# EAGLE design TAH Arduino Breakout Shield (EAGLE 7.0.0)
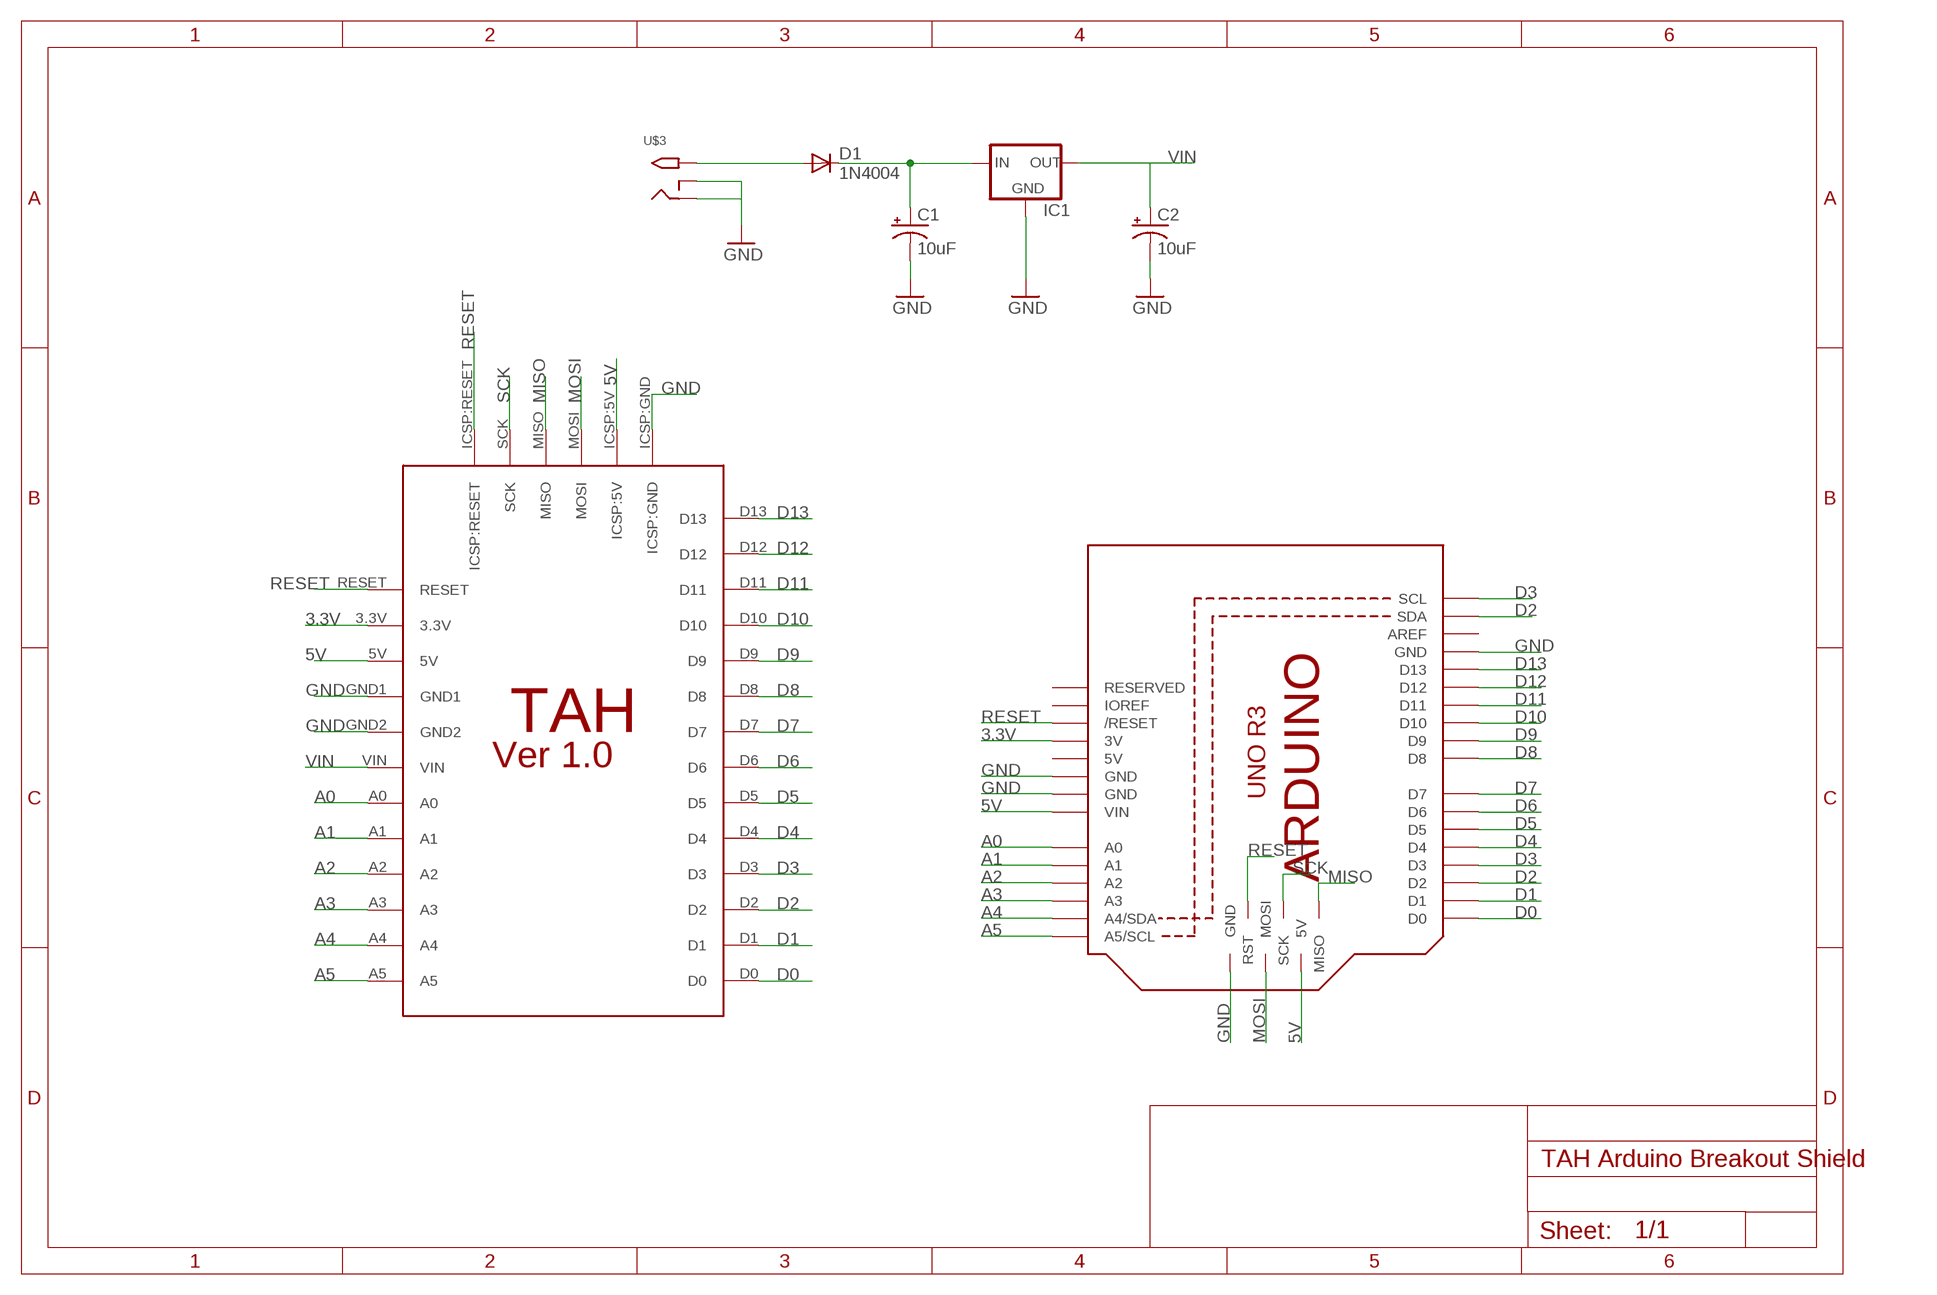
[diagram p0: schematic, sheet 1]

## Parts
C1  10uF  CPOL-USE2,5-6E  [E2,5-6E]
C2  10uF  CPOL-USE2,5-6E  [E2,5-6E]
D1  1N4004  [DO41-10]
IC1  V_REG_78XX-TO-220  [TO-220-ALT]
M1  ARDUINO_R3_ICSP_NODIM  [ARDUINOR3_ICSP_NODIM]
U$1  TAH_PIN_FOOTPRINT_VER1.0  [TAH_PIN_FOOTPRINT_VER1.0]
U$3  2.1MMJACKTHM  [PJ-102A]

## Nets
3.3V: M1.3V U$1.3.3V
5V: M1.5V_ICSP(5V) M1.VIN U$1.5V U$1.ICSP:5V
A0: M1.A0 U$1.A0
A1: M1.A1 U$1.A1
A2: M1.A2 U$1.A2
A3: M1.A3 U$1.A3
A4: M1.A4(A4/SDA) U$1.A4
A5: M1.A5(A5/SCL) U$1.A5
D0: M1.D0 U$1.D0
D1: M1.D1 U$1.D1
D2: M1.D2 M1.SDA U$1.D2
D3: M1.D3 M1.SCL U$1.D3
D4: M1.D4 U$1.D4
D5: M1.D5 U$1.D5
D6: M1.D6 U$1.D6
D7: M1.D7 U$1.D7
D8: M1.D8 U$1.D8
D9: M1.D9 U$1.D9
D10: M1.D10 U$1.D10
D11: M1.D11 U$1.D11
D12: M1.D12 U$1.D12
D13: M1.D13 U$1.D13
GND: C1.- C2.- IC1.GND M1.GND M1.GND@1(GND) M1.GND@2(GND) M1.GND@3(GND) U$1.GND1 U$1.GND2 U$1.ICSP:GND U$3.RING U$3.RING_SW
MISO: M1.MISO U$1.MISO
MOSI: M1.MOSI U$1.MOSI
N$4: D1.A U$3.TIP
N$5: C1.+ D1.C IC1.IN
RESET: M1.RESET(/RESET) M1.RESET_ICSP(RST) U$1.ICSP:RESET U$1.RESET
SCK: M1.SCK U$1.SCK
VIN: C2.+ IC1.OUT U$1.VIN
Unconnected: M1.AREF M1.IOREF M1.RESERVED

## Power pins joined to a net without a drawn wire
5V: M1.5V

## Library data of the parts
C1 C2 = Arduino Shield Pin Out:CPOL-US: POLARIZED CAPACITOR, American symbol
D1 = adafruit:1N4004: DIODE General purpose 1N400x type rectifier (With bigger pads) http://www.ladyada.net/library/pcb/eaglelibrary.html
IC1 = SparkFun-PowerIC:V_REG_78XX: Voltage Regulator Standard 7805 5V regulator. IGO (Input Ground Output). Spark Fun Electronics SKU : COM-00107
M1 = adafruit:ARDUINO_R3_ICSP
U$1 = TAH:TAH_PIN_FOOTPRINT_VER1.0
U$3 = 1n4148 diode sot 23:2.1MMJACK: 2.1mm x 5.5mm THM DC jack with internal switch. Digikey part #PJ-102A, 4UCON part #05537 2.1mm x 5.5mm SMT DC jack with internal switch. Digikey part #PJ-002A-SMT, 4UCON part #03267 By microbuilder.eu & adafruit.com

## Net classes
0 default: clearance 0.355 mm

## Board
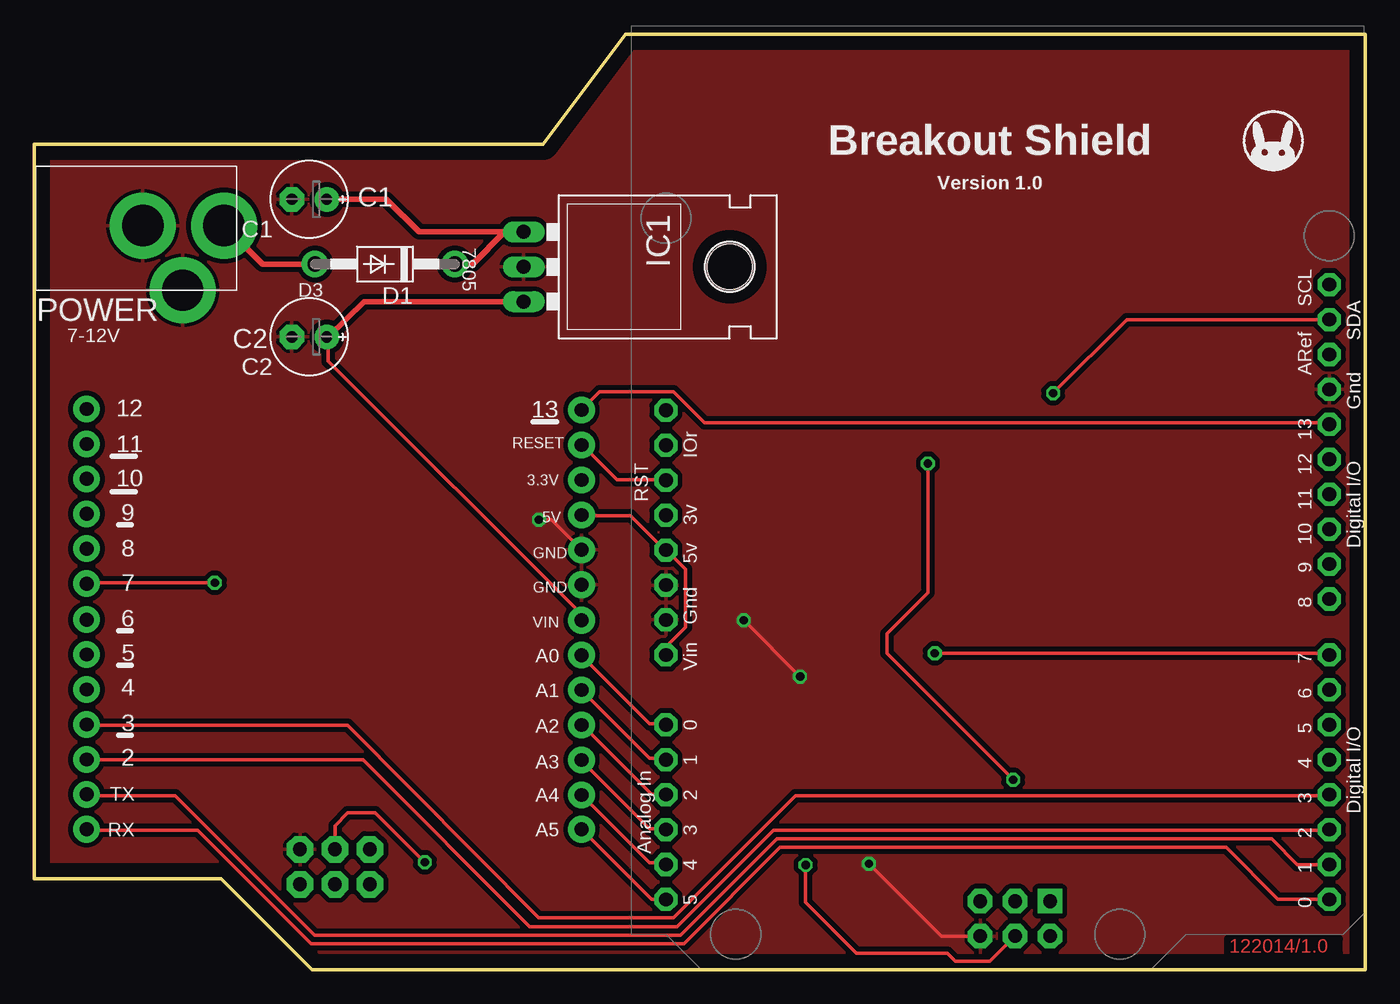
[diagram p1: board, top side]
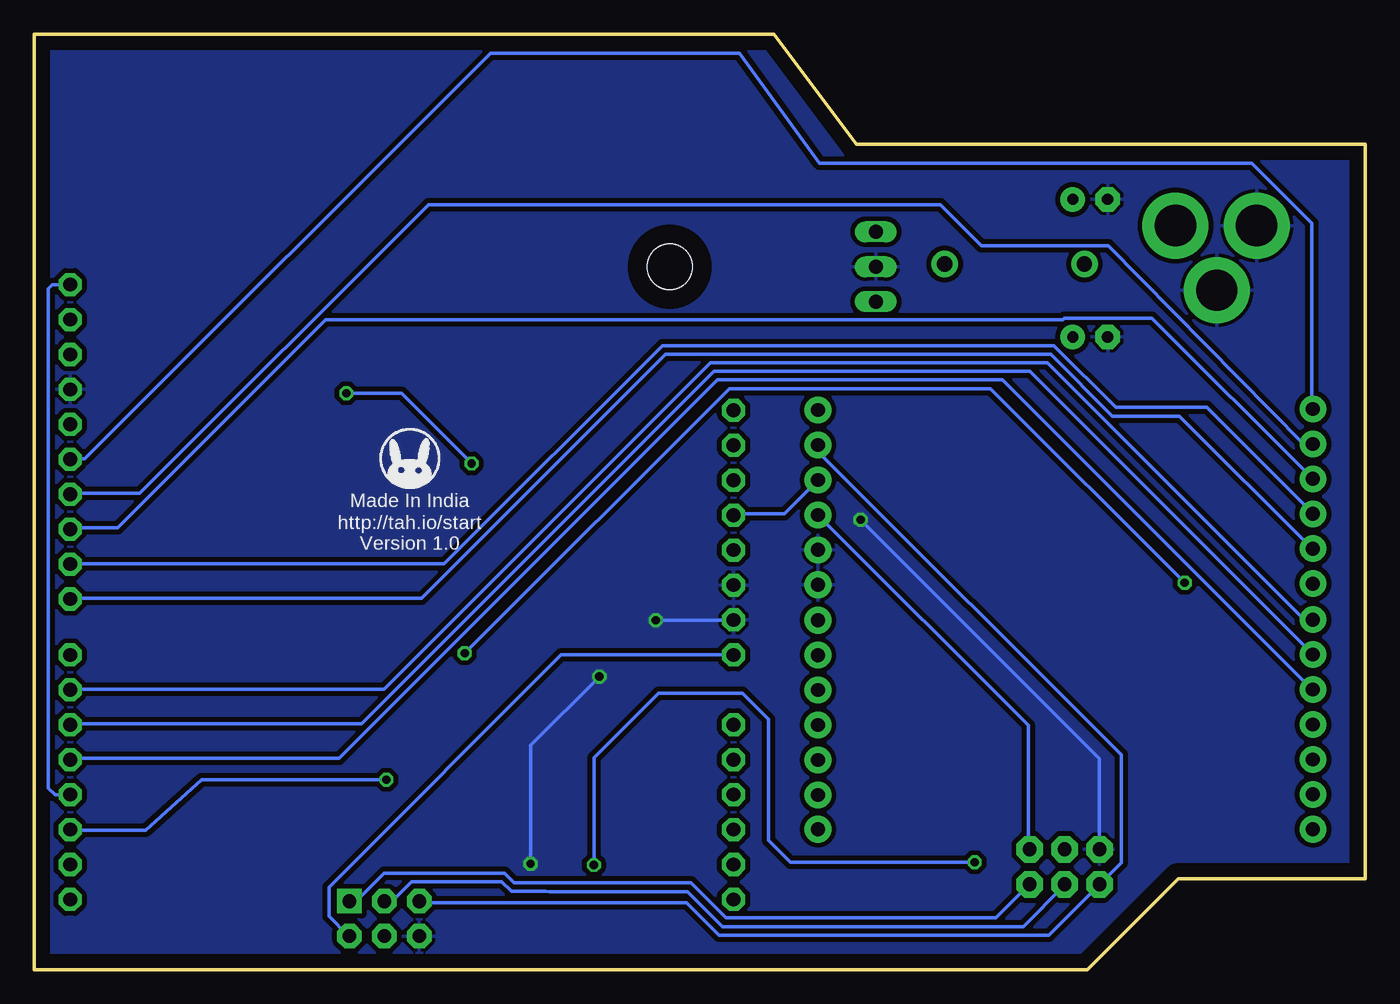
[diagram p2: board, bottom side, seen from below]

Size 96.8 x 68 mm. Coordinates in mm from the lower left corner, seen from the top.
Outline: 0,6.6 13.6,6.6 20.2,0 96.8,0 96.8,68 43,68 37,60 0,60 0,6.6
Copper layers (1*16): Top 0.035mm / dielectric 1.5mm / Bottom 0.035mm
Design rules "default": minimum track width 10mil, minimum drill 24mil, track to track 8mil, track to pad 8mil, pad to pad 8mil, via to via 8mil, smd to smd 8mil, copper to edge 40mil, drill to drill 8mil, minimum pad ring 10mil, minimum via ring 8mil, stop-mask expansion 4mil, vias tented up to drill 0mil, thermal gap 10mil

### Footprints (pad centres in the part's own frame; a part is rotated, then mirrored left to right if it is on the bottom)
E2,5-6E = drill 0.813 pad 1.778: + -1.27,0 | drill 0.813 pad 1.778 octagon: - 1.27,0
DO41-10 = drill 1.118 pad 1.93: A 5.08,0; C -5.08,0
TO-220-ALT = drill 1.016 long: GND 0,-3.81; IN -2.54,-3.81; OUT 2.54,-3.81 | hole 3.302: 0,11.176
ARDUINOR3_ICSP_NODIM = drill 1 pad 1.676 octagon: 3V 35.56,2.54; 5V 38.1,2.54; A0 50.8,2.54; A1 53.34,2.54; A2 55.88,2.54; A3 58.42,2.54; A4 60.96,2.54; A5 63.5,2.54; AREF 23.876,50.8; D0 63.5,50.8; D1 60.96,50.8; D2 58.42,50.8; D3 55.88,50.8; D4 53.34,50.8; D5 50.8,50.8; D6 48.26,50.8; D7 45.72,50.8; D8 41.656,50.8; D9 39.116,50.8; D10 36.576,50.8; D11 34.036,50.8; D12 31.496,50.8; D13 28.956,50.8; GND 26.416,50.8; GND@1 43.18,2.54; GND@2 40.64,2.54; IOREF 30.48,2.54; RESERVED 27.94,2.54; RESET 33.02,2.54; SCL 18.796,50.8; SDA 21.336,50.8; VIN 45.72,2.54 | drill 1 pad 1.778 octagon: 5V_ICSP 66.167,30.48; GND@3 66.167,25.4; MOSI 66.167,27.94; RESET_ICSP 63.627,25.4; SCK 63.627,27.94 | drill 1 pad 1.778 square: MISO 63.627,30.48
TAH_PIN_FOOTPRINT_VER1.0 = drill 1 pad 1.93: 3.3V -17.55,11.97; 5V -17.55,9.43; A0 -17.55,-0.77; A1 -17.55,-3.31; A2 -17.55,-5.85; A3 -17.55,-8.39; A4 -17.55,-10.93; A5 -17.55,-13.43; D0 18.45,-13.43; D1 18.45,-10.89; D2 18.45,-8.35; D3 18.45,-5.81; D4 18.45,-3.27; D5 18.45,-0.73; D6 18.45,1.81; D7 18.45,4.43; D8 18.45,6.97; D9 18.45,9.51; D10 18.45,12.05; D11 18.45,14.59; D12 18.45,17.13; D13 -17.55,17.05; GND1 -17.55,6.89; GND2 -17.55,4.35; RESET -17.55,14.51; VIN -17.55,1.77 | drill 1 pad 1.93 octagon: ICSP:5V -2.15,-14.89; ICSP:GND 2.93,-14.89; ICSP:RESET 2.93,-17.43; MISO -2.15,-17.43; MOSI 0.39,-14.89; SCK 0.39,-17.43
PJ-102A = drill 3 pad 4.8: RING 0.1,-3.39; RING_SW -4.6,-6.29; TIP 0.1,-9.29

### Placement (x,y rotation side)
C1  20,56 180 top
C2  20,46 180 top
D1  25.5,51.3 180 top
IC1  39.4,51.1 270 top
M1  43.4,68.6 270 top
U$1  22.25,23.63 0 bottom
U$2  [TAHLOGO]  90.1,60.3 0 top
U$3  4.5,54 90 top
U$4  [TAHLOGO]  69.5,37.2 0 bottom
U$5  [TAH_SILK_FLIPPED]  22.5,25.5 0 top

### Tracks (layer width: path | path; a pad name or v marks a point on that pad's centre or on a via)
3.3V
  Bottom 0.254: M1.3V 45.88,33.12 42.25,33.12 39.88,35.5 U$1.3.3V
5V
  Top 0.254: M1.VIN 46,23 46,23.5 47.38,24.88 47.38,29.12 46,30.5 M1.5V 45.88,30.5 43.38,33 39.88,33 U$1.5V
  Bottom 0.254: U$1.ICSP:5V 24.5,8.75 24.5,17.75 39.75,33 U$1.5V | M1.5V_ICSP 74,2.5 75.38,3.88 75.38,6 58.5,22.88 46,22.88 M1.VIN
A0
  Top 0.254: M1.A0 45.88,17.88 44.75,17.88 39.88,22.75 U$1.A0
A1
  Top 0.254: M1.A1 45.88,15.38 44.75,15.38 39.88,20.25 U$1.A1
A2
  Top 0.254: M1.A2 45.88,12.75 44.88,12.75 39.88,17.75 U$1.A2
A3
  Top 0.254: M1.A3 45.88,10.25 44.75,10.25 39.88,15.12 U$1.A3
A4
  Top 0.254: U$1.A4 44.75,7.75 45.88,7.75 M1.A4
A5
  Top 0.254: U$1.A5 44.88,5.12 45.88,5.12 M1.A5
D0
  Top 0.254: M1.D0 94.12,5.12 90.45,5.12 86.7,8.88 54.25,8.88 47.25,1.88 20.12,1.88 11.88,10.12 3.88,10.12 U$1.D0
D1
  Top 0.254: M1.D1 94.12,7.62 91.88,7.62 90,9.5 54.02,9.53 47,2.5 20.38,2.5 10.25,12.62 3.88,12.62 U$1.D1
D2  (via drill 0.6)
  Top 0.254: M1.D2 94.12,10.12 53.75,10.12 46.75,3.12 36.02,3.12 23.9,15.25 3.88,15.25 U$1.D2 | M1.SDA 79.46,47.26 v74.1,41.9 | v65,36.8 65,27.4 62,24.4 62,23 v71.2,13.8
  Bottom 0.254: v74.1,41.9 70.1,41.9 v65,36.8 | v71.2,13.8 84.62,13.8 88.7,10.12 94.14,10.12 M1.D2
D3
  Top 0.254: M1.D3 94.12,12.62 55.38,12.62 46.5,3.75 36.67,3.75 22.77,17.75 3.88,17.75 U$1.D3
  Bottom 0.254: M1.SCL 95.5,49.8 95.8,49.5 95.8,13.2 95.3,12.7 94.22,12.7 M1.D3
D4
  Bottom 0.254: M1.D4 94.12,15.38 74.62,15.38 47.12,42.88 26.38,42.88 3.88,20.38 U$1.D4
D5
  Bottom 0.254: M1.D5 94.12,17.88 73,17.88 47.38,43.5 24.38,43.5 3.88,23 U$1.D5
D6
  Bottom 0.254: M1.D6 94.12,20.38 71.38,20.38 47.62,44.12 23.12,44.12 4.5,25.5 3.88,25.5 U$1.D6
D7  (via drill 0.61)
  Top 0.254: v65.5,23 94.12,23 M1.D7 | v13.12,28.12 3.88,28.12 U$1.D7
  Bottom 0.254: v65.5,23 46.25,42.25 27.25,42.25 v13.12,28.12
D8
  Bottom 0.254: M1.D8 94.12,27 68.62,27 50.88,44.75 22.88,44.75 18.38,40.25 13.5,40.25 3.88,30.62 U$1.D8
D9
  Bottom 0.254: M1.D9 94.12,29.5 67,29.5 51.12,45.38 22.62,45.38 18.12,40.88 11.5,40.88 3.88,33.25 U$1.D9
D10
  Bottom 0.254: M1.D10 94.12,32.12 90.75,32.12 75.62,47.25 22,47.25 21.88,47.38 15.5,47.38 3.88,35.75 U$1.D10
D11
  Bottom 0.254: M1.D11 94.12,34.62 89.12,34.62 68.12,55.62 30.9,55.6 27.93,52.62 18.68,52.62 4.5,38.25 3.88,38.25 U$1.D11
D12
  Bottom 0.254: M1.D12 94.12,37.12 93.12,37.12 63.62,66.62 45.5,66.62 39.7,58.62 8.25,58.62 3.88,54.25 3.88,40.88 U$1.D12
D13
  Top 0.254: M1.D13 94.12,39.75 48.75,39.75 46.5,42 41.12,42 39.88,40.75 U$1.D13
GND  (via drill 0.6)
  Top 0.254: v36.7,32.7 37.62,32.7 U$1.GND1 | M1.GND@3 65.97,2.43 v60.7,7.7 | v55.7,21.3 v51.6,25.4
  Bottom 0.254: U$1.ICSP:GND 19.32,15.32 v36.7,32.7 | v60.7,7.7 60.7,16.3 v55.7,21.3 | v51.6,25.4 45.96,25.4 M1.GND@1
  pour Bottom: 0,6.6 0,60 37,60 43,68 97,68 97,0 20.2,0 13.6,6.6
  pour Top: 0,6.6 0,60 37,60 43,68 97,68 97,0 20.3,0 20.2,0 13.6,6.6
MISO
  Bottom 0.254: M1.MISO 73.88,5 73.38,5 71.38,7 62.6,7 61.9,6.3 49.05,6.3 46.5,3.75 26.88,3.75 24.5,6.12 U$1.MISO
MOSI  (via drill 0.6)
  Top 0.254: U$1.MOSI 21.86,10.46 22.8,11.4 24.8,11.4 v28.4,7.8 | v56.1,7.6 56.1,4.9 59.8,1.2 66.4,1.2 67,0.6 69.51,0.6 M1.MOSI
  Bottom 0.254: v28.4,7.8 41.8,7.8 43.4,9.4 43.4,18.2 45.3,20.1 51.4,20.1 56.1,15.4 v56.1,7.6
N$4
  Top 0.406: D1.A 16.59,51.3 U$3.TIP
N$5
  Top 0.406: C1.+ 25.6,56 28,53.64 34.2,53.64 | 34.2,53.64 IC1.IN | D1.C 31.86,51.3 34.2,53.64
RESET
  Top 0.254: M1.RESET 45.88,35.62 42.38,35.62 39.88,38.12 U$1.RESET
  Bottom 0.254: M1.RESET_ICSP 68.75,4.88 49.38,4.88 47,2.5 23,2.5 19.38,6.12 U$1.ICSP:RESET 19.25,6.25 17.75,7.75 17.75,15.62 39.75,37.62 39.75,38.12 U$1.RESET
SCK
  Bottom 0.254: M1.SCK 71.25,5 70.75,5 69.38,6.38 62.8,6.4 62.1,5.7 59.6,5.7 59.33,5.67 49.3,5.67 46.75,3.12 24.88,3.12 21.88,6.12 U$1.SCK
VIN
  Top 0.254: 21.38,46 C2.+ 21.38,45.88 21.38,44.25 39.75,25.88 39.75,25.5 U$1.VIN
  Top 0.406: 21.38,46 23.98,48.56 IC1.OUT

### Text on the board
Top: 122014/1.0
tPlace: Breakout Shield | Version 1.0
bPlace: Made In India | http://tah.io/start | Version 1.0
_tNames: C1 | 7805 | D3 | POWER | 7-12V | C2